# Altium schematic sheet JTAG_ALTIUM_AUTO.SchDoc: Auto-Detect JTAG Circuit
size A4; Organization: Altium Limited.; Address1: Level 3, 12a Rodborough Rd; Address2: Frenchs Forest 2086; Address3: NSW; Address4: AUSTRALIA; SheetNumber: 1; SheetTotal: 100
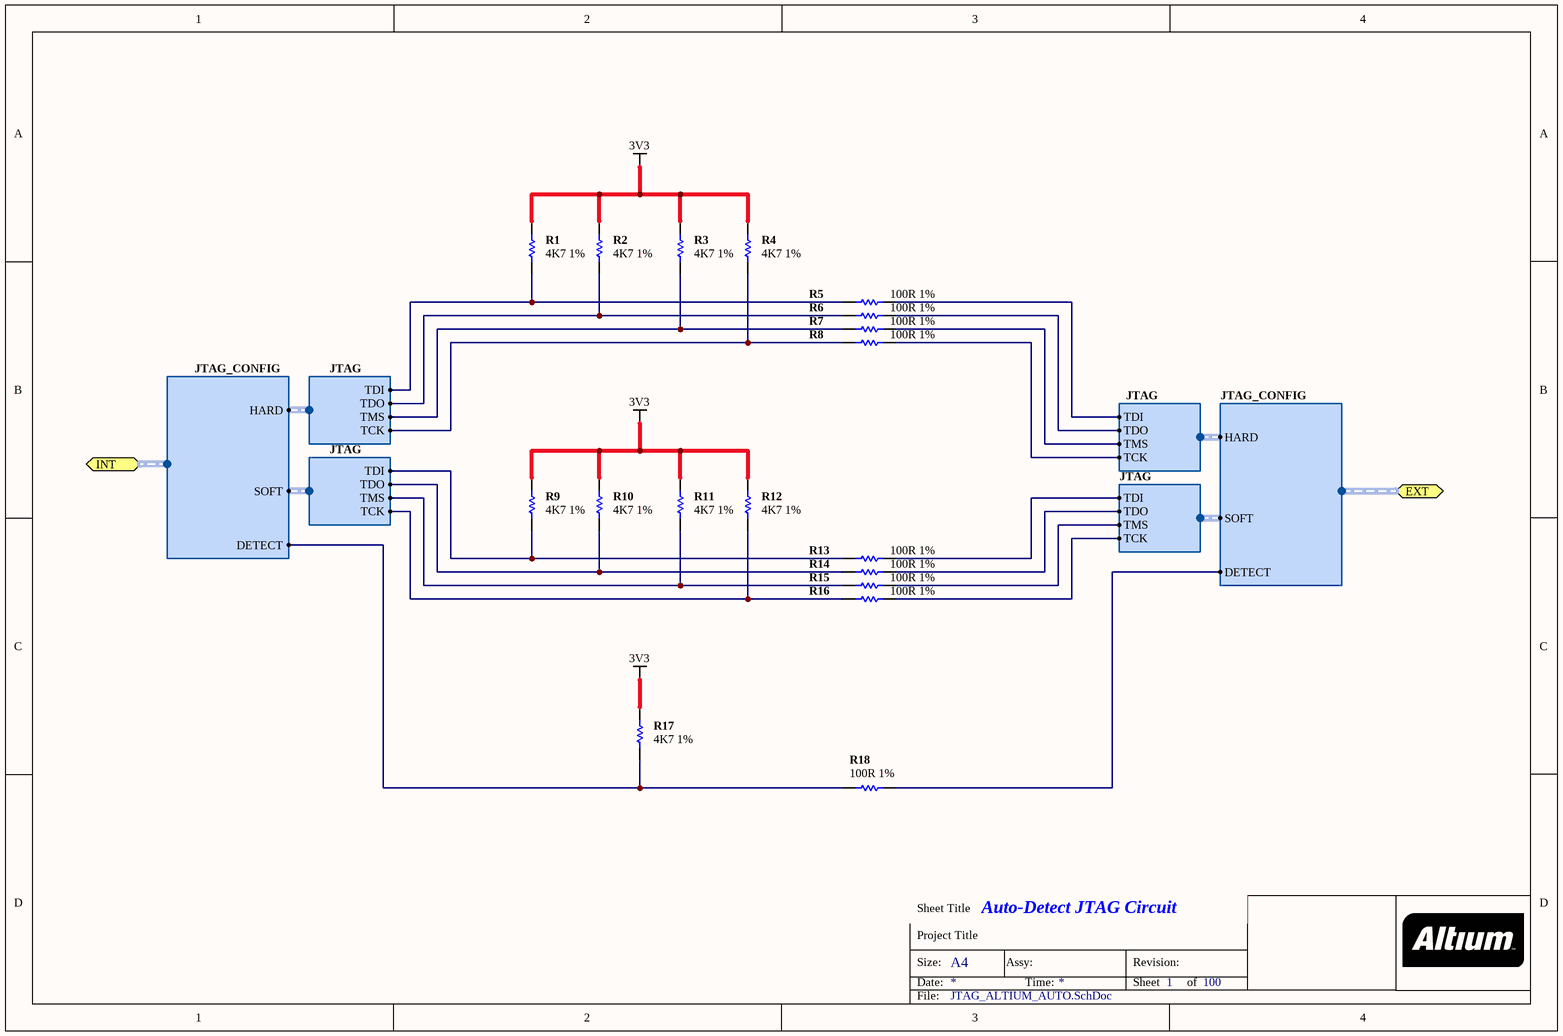
[diagram p0: JTAG_ALTIUM_AUTO.SchDoc]

## Parts
R1  4K7 1%  [RESC1005-STAR]
R2  4K7 1%  [RESC1005-STAR]
R3  4K7 1%  [RESC1005-STAR]
R4  4K7 1%  [RESC1005-STAR]
R5  100R 1%  [RESC1005-STAR]
R6  100R 1%  [RESC1005-STAR]
R7  100R 1%  [RESC1005-STAR]
R8  100R 1%  [RESC1005-STAR]
R9  4K7 1%  [RESC1005-STAR]
R10  4K7 1%  [RESC1005-STAR]
R11  4K7 1%  [RESC1005-STAR]
R12  4K7 1%  [RESC1005-STAR]
R13  100R 1%  [RESC1005-STAR]
R14  100R 1%  [RESC1005-STAR]
R15  100R 1%  [RESC1005-STAR]
R16  100R 1%  [RESC1005-STAR]
R17  4K7 1%  [RESC1005-STAR]
R18  100R 1%  [RESC1005-STAR]

## Ports
EXT (harness JTAG_CONFIG), INT (harness JTAG_CONFIG)

## Harnesses
JTAG_CONFIG: HARD, SOFT, DETECT
JTAG: TDI, TDO, TCK, TMS

## Nets
3V3: R1.2 R2.2 R3.2 R4.2 R9.2 R10.2 R11.2 R12.2 R17.2
NetR1_1: R1.1 R5.1 ; harness JTAG.TDI
NetR2_1: R2.1 R6.1 ; harness JTAG.TDO
NetR3_1: R3.1 R7.1 ; harness JTAG.TMS
NetR4_1: R4.1 R8.1 ; harness JTAG.TCK
NetR5_2: R5.2 ; harness JTAG.TDI
NetR6_2: R6.2 ; harness JTAG.TDO
NetR7_2: R7.2 ; harness JTAG.TMS
NetR8_2: R8.2 ; harness JTAG.TCK
NetR9_1: R9.1 R13.1 ; harness JTAG.TDI
NetR10_1: R10.1 R14.1 ; harness JTAG.TDO
NetR11_1: R11.1 R15.1 ; harness JTAG.TMS
NetR12_1: R12.1 R16.1 ; harness JTAG.TCK
NetR13_2: R13.2 ; harness JTAG.TDI
NetR14_2: R14.2 ; harness JTAG.TDO
NetR15_2: R15.2 ; harness JTAG.TMS
NetR16_2: R16.2 ; harness JTAG.TCK
NetR17_1: R17.1 R18.1 ; port INT.DETECT
NetR18_2: R18.2 ; port EXT.DETECT

## Notes on the sheet
- Sheet Title
- Project Title
- Size:
- Date:
- A4
- Assy:
- Time:
- Revision:
- Sheet
- of
- File:

## Library data of the parts
R1-R4 R9-R12 R17 = D-100-0088: Resistor, 4K7 1% 0402 (1005); Power Rating: 63 mW; Resistance: 4.7 K; Category: Resistor; Mounting Technology: Surface Mount; Status: Production; Tolerance: 1 %
R5-R8 R13-R16 R18 = D-100-0131: Resistor, 100R 1% 0402 (1005); Power Rating: 63 mW; Category: Resistor; Mounting Technology: Surface Mount; Resistance: 100 R; Status: Production; Tolerance: 1 %